# EAGLE design rpi2_gpio (EAGLE 7.6.0)
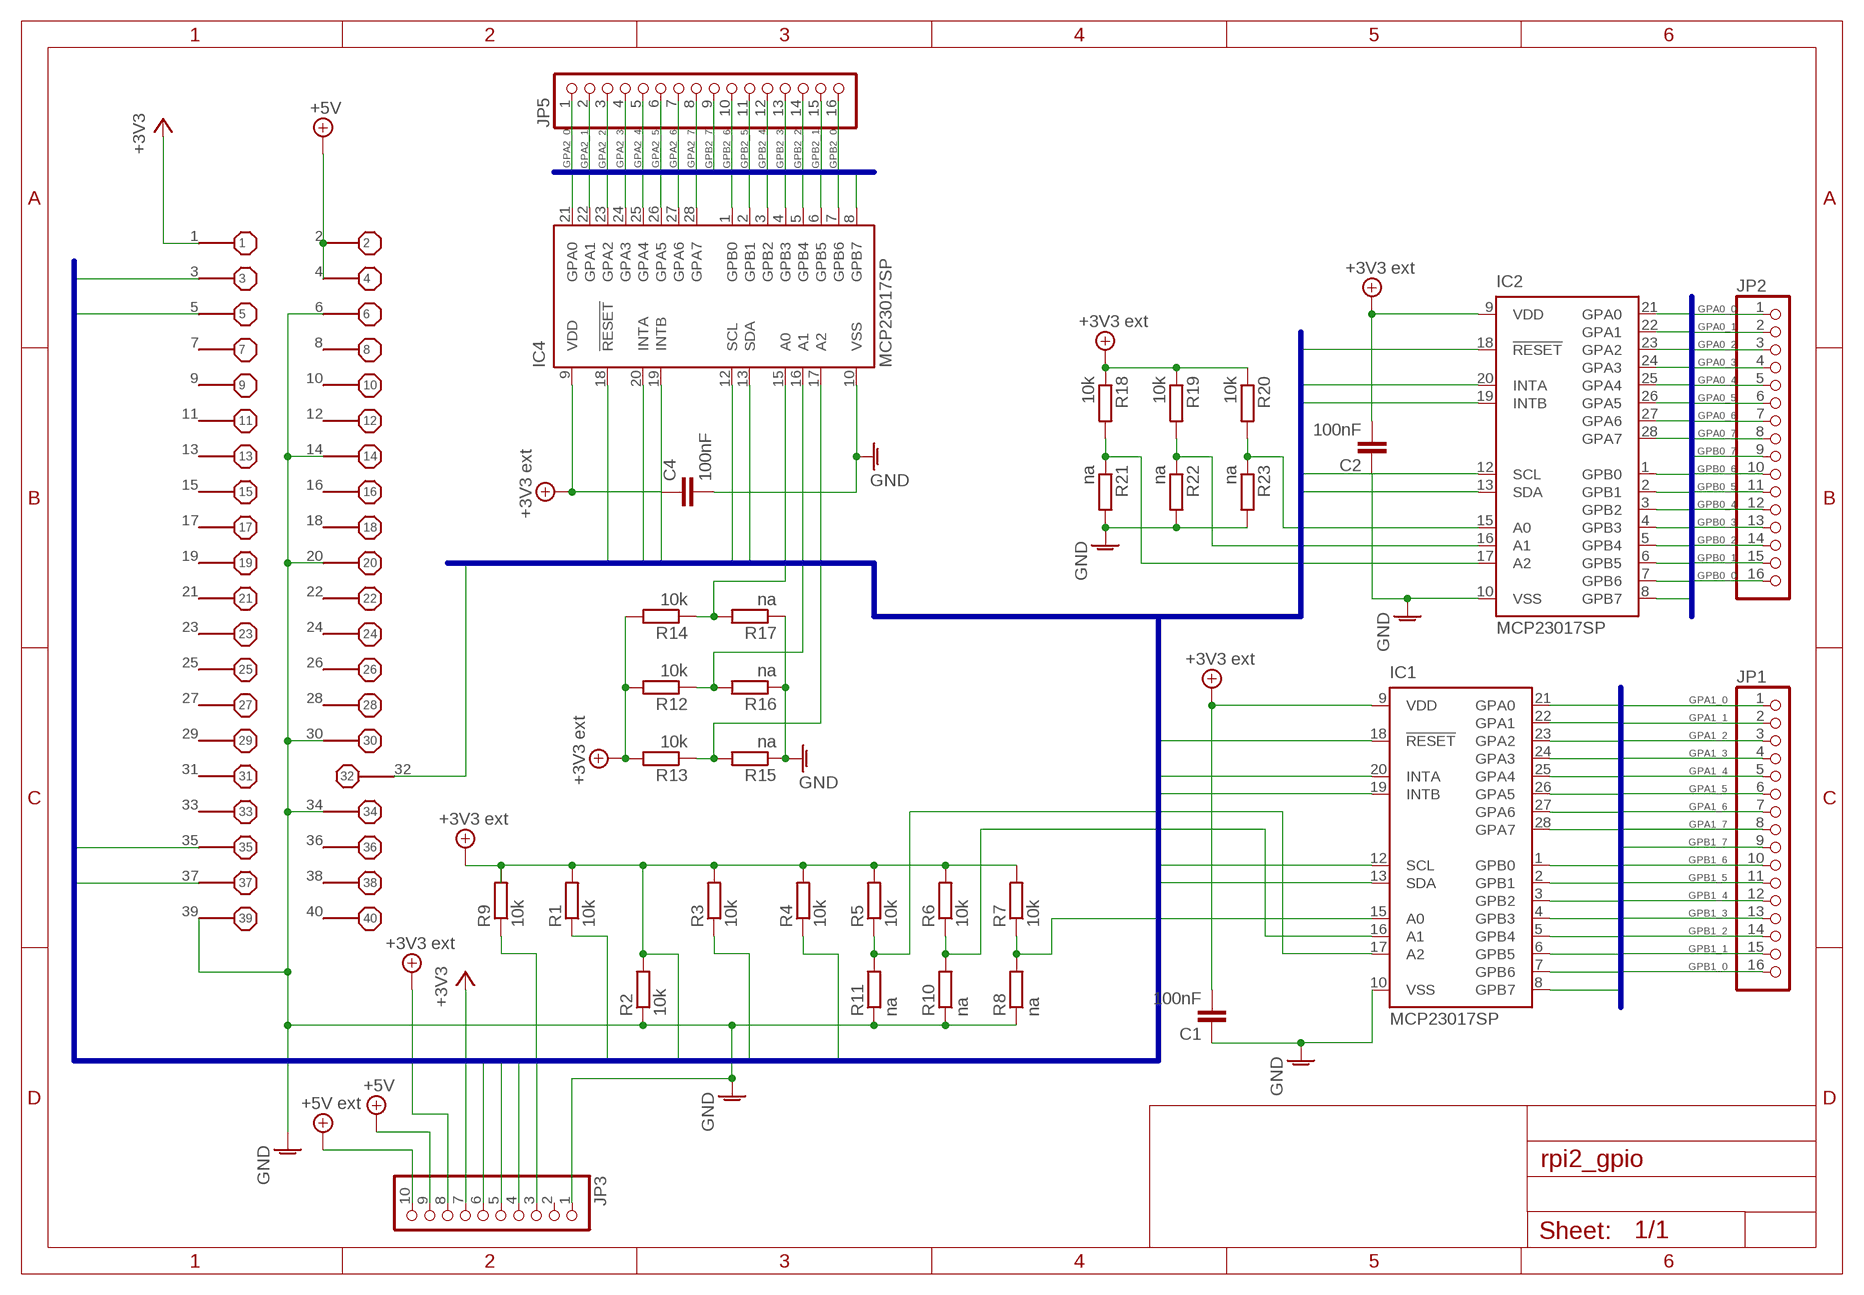
[diagram p0: schematic, sheet 1]

## Parts
C1  100nF  C-EUC1210  [C1210]
C2  100nF  C-EUC1210  [C1210]
C4  100nF  C-EUC1210  [C1210]
IC1  MCP23017SP  [DIL28-3]
IC2  MCP23017SP  [DIL28-3]
IC4  MCP23017SP  [DIL28-3]
JP1  PINHD-1X16  [1X16]
JP2  PINHD-1X16  [1X16]
JP3  PINHD-1X10  [1X10]
JP5  PINHD-1X16  [1X16]
R1  10k  R-EU_R0805  [R0805]
R2  10k  R-EU_R0805  [R0805]
R3  10k  R-EU_R0805  [R0805]
R4  10k  R-EU_R0805  [R0805]
R5  10k  R-EU_R0805  [R0805]
R6  10k  R-EU_R0805  [R0805]
R7  10k  R-EU_R0805  [R0805]
R8  na  R-EU_R0805  [R0805]
R9  10k  R-EU_R0805  [R0805]
R10  na  R-EU_R0805  [R0805]
R11  na  R-EU_R0805  [R0805]
R12  10k  R-EU_R0805  [R0805]
R13  10k  R-EU_R0805  [R0805]
R14  10k  R-EU_R0805  [R0805]
R15  na  R-EU_R0805  [R0805]
R16  na  R-EU_R0805  [R0805]
R17  na  R-EU_R0805  [R0805]
R18  10k  R-EU_R0805  [R0805]
R19  10k  R-EU_R0805  [R0805]
R20  10k  R-EU_R0805  [R0805]
R21  na  R-EU_R0805  [R0805]
R22  na  R-EU_R0805  [R0805]
R23  na  R-EU_R0805  [R0805]
X1  B+_GPIO  [B+_GPIO]

## Nets
3.3VEXT: IC1.18(!RESET) IC2.18(!RESET) IC4.18(!RESET) R1.2 R2.2 R3.2 R4.2 R5.2 R6.2 R7.2 R9.2 X1.32 ; supply symbol labelled +3V3 ext
3V3EXT: C1.2 IC1.9(VDD) R12.2 R13.2 R14.2 R18.1 R19.1 R20.1 ; supply symbol labelled +3V3 ext
+3V3: JP3.7 X1.1
+5V: JP3.9 X1.2 X1.4
+5V/1: JP3.10 ; supply symbol labelled +5V ext
+5V/2: C2.2 C4.1 IC2.9(VDD) IC4.9(VDD) JP3.8 ; supply symbol labelled +3V3 ext
GND: C1.1 C2.1 C4.2 IC1.10(VSS) IC2.10(VSS) IC4.10(VSS) JP3.1 R2.1 R8.1 R10.1 R11.1 R15.1 R16.1 R17.1 R21.2 R22.2 R23.2 X1.6 X1.14 X1.20 X1.30 X1.34 X1.39
GPA0_0: IC2.21(GPA0) JP2.1
GPA0_1: IC2.22(GPA1) JP2.2
GPA0_2: IC2.23(GPA2) JP2.3
GPA0_3: IC2.24(GPA3) JP2.4
GPA0_4: IC2.25(GPA4) JP2.5
GPA0_5: IC2.26(GPA5) JP2.6
GPA0_6: IC2.27(GPA6) JP2.7
GPA0_7: IC2.28(GPA7) JP2.8
GPA1_0: IC1.21(GPA0) JP1.1
GPA1_1: IC1.22(GPA1) JP1.2
GPA1_2: IC1.23(GPA2) JP1.3
GPA1_3: IC1.24(GPA3) JP1.4
GPA1_4: IC1.25(GPA4) JP1.5
GPA1_5: IC1.26(GPA5) JP1.6
GPA1_6: IC1.27(GPA6) JP1.7
GPA1_7: IC1.28(GPA7) JP1.8
GPA2_0: IC4.21(GPA0) JP5.1
GPA2_1: IC4.22(GPA1) JP5.2
GPA2_2: IC4.23(GPA2) JP5.3
GPA2_3: IC4.24(GPA3) JP5.4
GPA2_4: IC4.25(GPA4) JP5.5
GPA2_5: IC4.26(GPA5) JP5.6
GPA2_6: IC4.27(GPA6) JP5.7
GPA2_7: IC4.28(GPA7) JP5.8
GPB0_0: IC2.1(GPB0) JP2.16
GPB0_1: IC2.2(GPB1) JP2.15
GPB0_2: IC2.3(GPB2) JP2.14
GPB0_3: IC2.4(GPB3) JP2.13
GPB0_4: IC2.5(GPB4) JP2.12
GPB0_5: IC2.6(GPB5) JP2.11
GPB0_6: IC2.7(GPB6) JP2.10
GPB0_7: IC2.8(GPB7) JP2.9
GPB1_0: IC1.1(GPB0) JP1.16
GPB1_1: IC1.2(GPB1) JP1.15
GPB1_2: IC1.3(GPB2) JP1.14
GPB1_3: IC1.4(GPB3) JP1.13
GPB1_4: IC1.5(GPB4) JP1.12
GPB1_5: IC1.6(GPB5) JP1.11
GPB1_6: IC1.7(GPB6) JP1.10
GPB1_7: IC1.8(GPB7) JP1.9
GPB2_0: IC4.1(GPB0) JP5.16
GPB2_1: IC4.2(GPB1) JP5.15
GPB2_2: IC4.3(GPB2) JP5.14
GPB2_3: IC4.4(GPB3) JP5.13
GPB2_4: IC4.5(GPB4) JP5.12
GPB2_5: IC4.6(GPB5) JP5.11
GPB2_6: IC4.7(GPB6) JP5.10
GPB2_7: IC4.8(GPB7) JP5.9
INTA: IC1.20(INTA) IC2.20(INTA) IC4.20(INTA) JP3.5 R4.1 X1.37
INTB: IC1.19(INTB) IC2.19(INTB) IC4.19(INTB) JP3.6 R3.1 X1.35
N$1: IC1.17(A2) R5.1 R11.2
N$2: IC1.16(A1) R6.1 R10.2
N$5: IC2.17(A2) R18.2 R21.1
N$7: IC2.16(A1) R19.2 R22.1
N$8: IC1.15(A0) R7.1 R8.2
N$9: IC2.15(A0) R20.2 R23.1
N$20: IC4.17(A2) R13.1 R15.2
N$21: IC4.16(A1) R12.1 R16.2
N$22: IC4.15(A0) R14.1 R17.2
SCL: IC1.12(SCL) IC2.12(SCL) IC4.12(SCL) JP3.4 R1.1 X1.5
SDA: IC1.13(SDA) IC2.13(SDA) IC4.13(SDA) JP3.3 R9.1 X1.3
Unconnected: JP3.2 X1.7 X1.8 X1.9 X1.10 X1.11 X1.12 X1.13 X1.15 X1.16 X1.17 X1.18 X1.19 X1.21 X1.22 X1.23 X1.24 X1.25 X1.26 X1.27 X1.28 X1.29 X1.31 X1.33 X1.36 X1.38 X1.40

## Buses
GPA2_[0..7],GPB2_[0..7]
INTA,INTB,SCL,SDA,NRES
GPA0_[0..7],GPB0_[0..7]
GPA1_[0..7],GPB1_[0..7]

## Library data of the parts
C1 C2 C4 = rcl:C-EU: CAPACITOR, European symbol
IC1 IC2 IC4 = microchip:MCP23017: http://ww1.microchip.com/downloads/en/DeviceDoc/21952a.pdf Source: http://ww1.microchip.com/downloads/en/DeviceDoc/21952a.pdf; MF: MICROCHIP; MPN: MCP23017-E/SP; OC_FARNELL: 1332088; OC_NEWARK: 31K2959
JP1 JP2 JP5 = pinhead:PINHD-1X16: PIN HEADER
JP3 = pinhead:PINHD-1X10: PIN HEADER
R1-R23 = rcl:R-EU_: RESISTOR, European symbol
X1 = raspberry:B+_GPIO

## Board
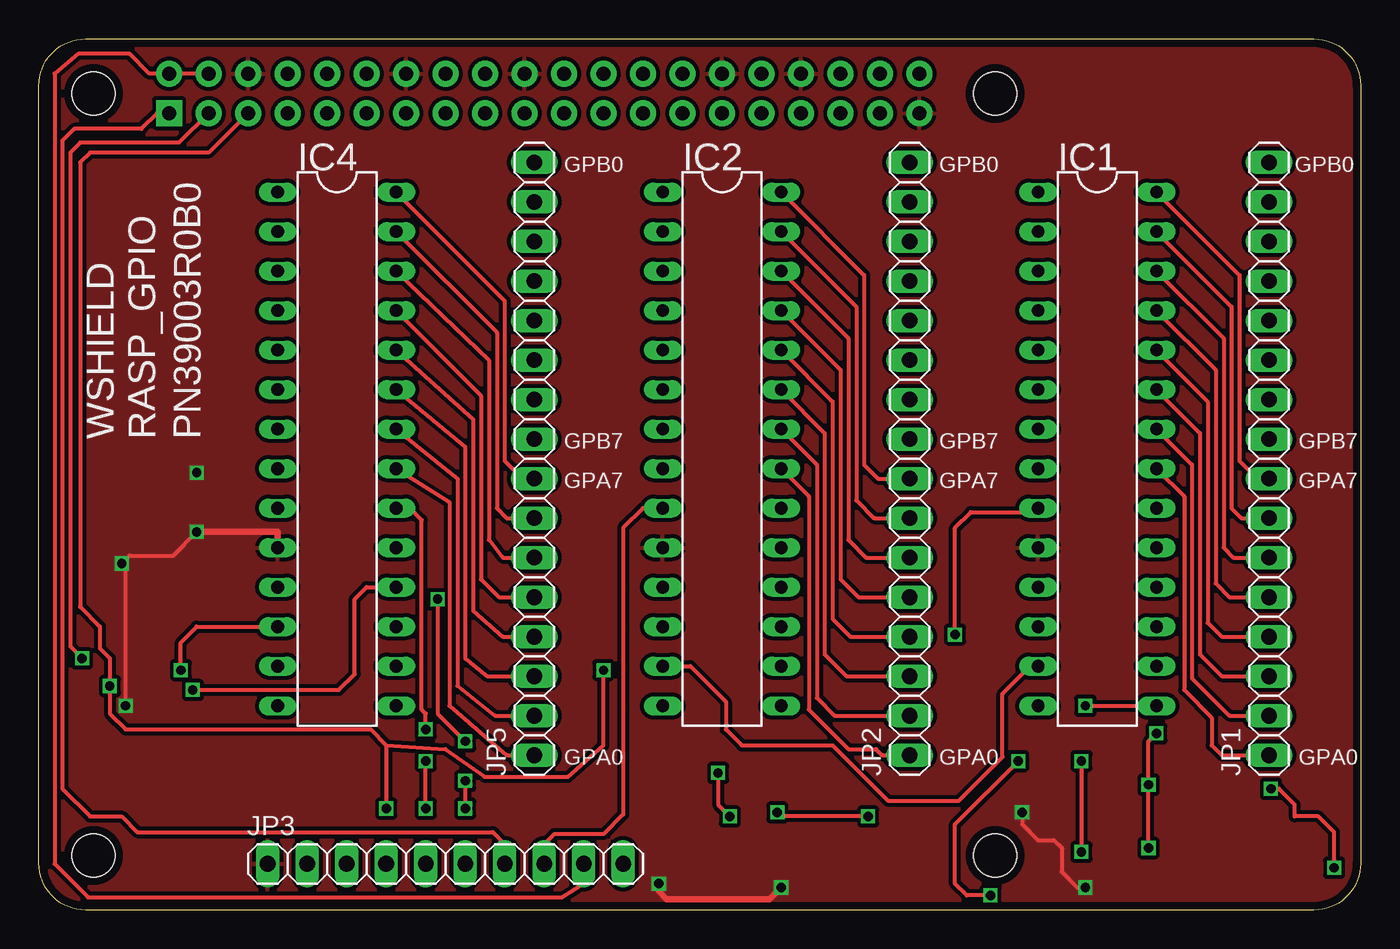
[diagram p1: board, top side]
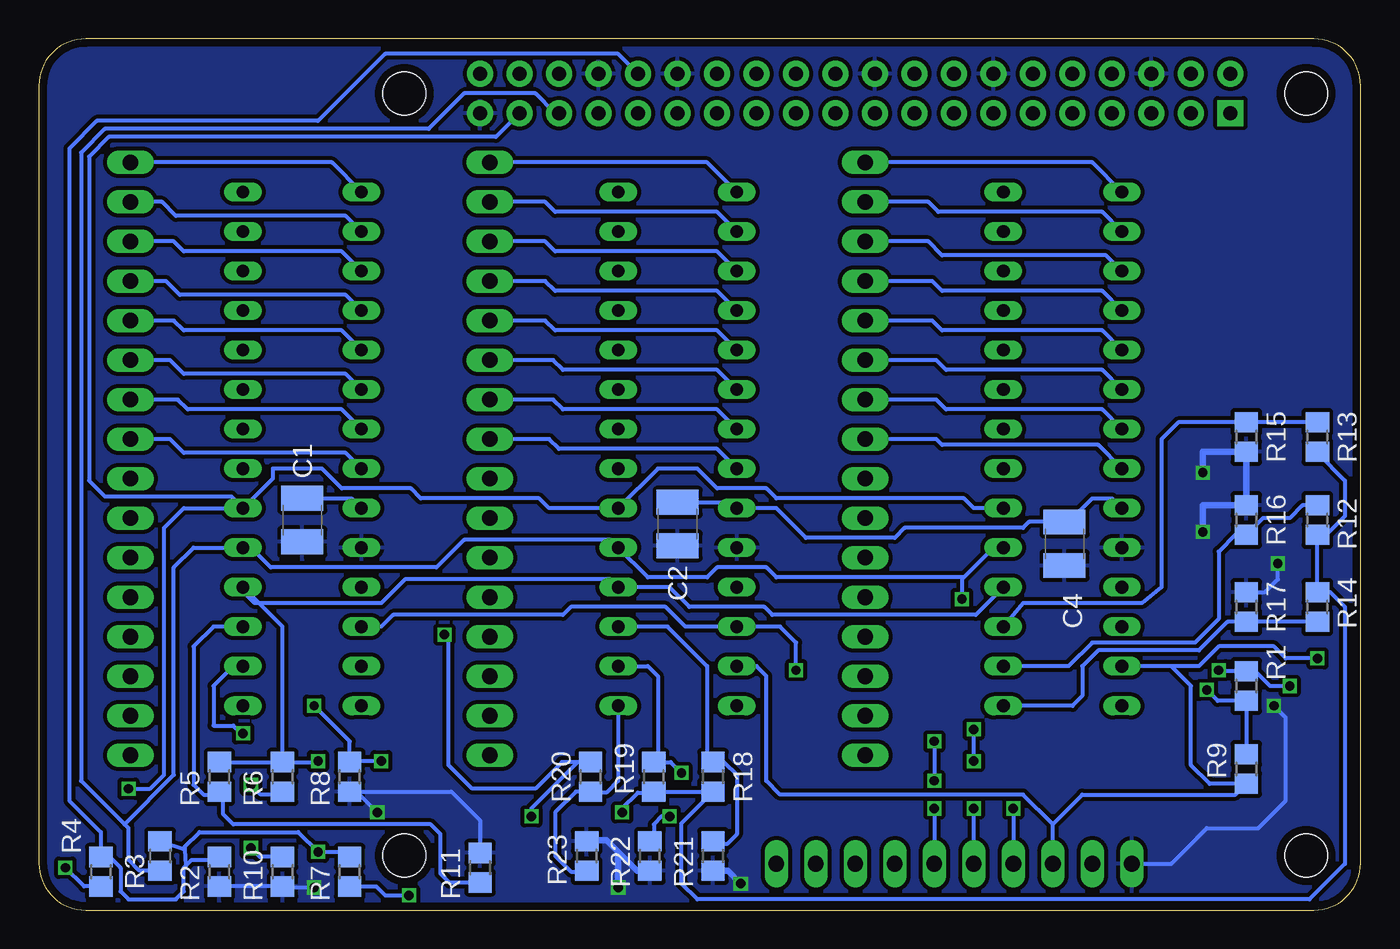
[diagram p2: board, bottom side, seen from below]

Size 85 x 56 mm. Coordinates in mm from the lower left corner, seen from the top.
Outline: 0,53 arc-90 3,56 82,56 arc-90 85,53 85,3 arc-90 82,0 3,0 arc-90 0,3 0,53
Copper layers (1*16): Top 0.035mm / dielectric 1.6mm / Bottom 0.035mm
Design rules "Elecrow_2-layer_PCB_eagle_rule": minimum track width 6mil, minimum drill 12mil, track to track 6mil, track to pad 6mil, pad to pad 6mil, via to via 8mil, smd to smd 0mil, copper to edge 20mil, drill to drill 10mil, minimum pad ring 6mil, minimum via ring 6mil, stop-mask expansion 0mil, vias tented up to drill 100mil, thermal gap 10mil
Holes 2.75 mm at 3.5,52.5 3.5,3.5 61.5,52.5 61.5,3.5

### Footprints (pad centres in the part's own frame; a part is rotated, then mirrored left to right if it is on the bottom)
C1210 = smd 1.6 x 2.7: 1 -1.4,0; 2 1.4,0
DIL28-3 = drill 0.813 long: 1 -16.51,-3.81; 2 -13.97,-3.81; 3 -11.43,-3.81; 4 -8.89,-3.81; 5 -6.35,-3.81; 6 -3.81,-3.81; 7 -1.27,-3.81; 8 1.27,-3.81; 9 3.81,-3.81; 10 6.35,-3.81; 11 8.89,-3.81; 12 11.43,-3.81; 13 13.97,-3.81; 14 16.51,-3.81; 15 16.51,3.81; 16 13.97,3.81; 17 11.43,3.81; 18 8.89,3.81; 19 6.35,3.81; 20 3.81,3.81; 21 1.27,3.81; 22 -1.27,3.81; 23 -3.81,3.81; 24 -6.35,3.81; 25 -8.89,3.81; 26 -11.43,3.81; 27 -13.97,3.81; 28 -16.51,3.81
1X16 = drill 1.016 long: 1 -19.05,0; 2 -16.51,0; 3 -13.97,0; 4 -11.43,0; 5 -8.89,0; 6 -6.35,0; 7 -3.81,0; 8 -1.27,0; 9 1.27,0; 10 3.81,0; 11 6.35,0; 12 8.89,0; 13 11.43,0; 14 13.97,0; 15 16.51,0; 16 19.05,0
1X10 = drill 1.016 long: 1 -11.43,0; 2 -8.89,0; 3 -6.35,0; 4 -3.81,0; 5 -1.27,0; 6 1.27,0; 7 3.81,0; 8 6.35,0; 9 8.89,0; 10 11.43,0
R0805 = smd 1.3 x 1.5: 1 -0.95,0; 2 0.95,0
B+_GPIO = drill 0.9 pad 1.676 square: 1 -24.13,-1.27 | drill 0.9 pad 1.676: 2 -24.13,1.27; 3 -21.59,-1.27; 4 -21.59,1.27; 5 -19.05,-1.27; 6 -19.05,1.27; 7 -16.51,-1.27; 8 -16.51,1.27; 9 -13.97,-1.27; 10 -13.97,1.27; 11 -11.43,-1.27; 12 -11.43,1.27; 13 -8.89,-1.27; 14 -8.89,1.27; 15 -6.35,-1.27; 16 -6.35,1.27; 17 -3.81,-1.27; 18 -3.81,1.27; 19 -1.27,-1.27; 20 -1.27,1.27; 21 1.27,-1.27; 22 1.27,1.27; 23 3.81,-1.27; 24 3.81,1.27; 25 6.35,-1.27; 26 6.35,1.27; 27 8.89,-1.27; 28 8.89,1.27; 29 11.43,-1.27; 30 11.43,1.27; 31 13.97,-1.27; 32 13.97,1.27; 33 16.51,-1.27; 34 16.51,1.27; 35 19.05,-1.27; 36 19.05,1.27; 37 21.59,-1.27; 38 21.59,1.27; 39 24.13,-1.27; 40 24.13,1.27

### Placement (x,y rotation side)
C1  68.06,25.07 90 bottom
C2  43.93,24.81 90 bottom
C4  19.04,23.54 270 bottom
IC1  68.06,29.64 270 top
IC2  43.93,29.64 270 top
IC4  19.16,29.64 270 top
JP1  79.11,29 90 top
JP2  55.99,29 90 top
JP3  26.15,2.97 0 top
JP5  31.87,29 90 top
R1  7.35,14.4 270 bottom
R2  73.39,2.46 90 bottom
R3  77.2,3.48 90 bottom
R4  81.01,2.46 90 bottom
R5  73.39,8.56 90 bottom
R6  69.33,8.56 90 bottom
R7  65.01,2.46 90 bottom
R8  65.01,8.56 90 bottom
R9  7.35,9.07 90 bottom
R10  69.33,2.46 90 bottom
R11  56.63,2.72 270 bottom
R12  2.78,25.07 270 bottom
R13  2.78,30.4 270 bottom
R14  2.78,19.48 90 bottom
R15  7.35,30.4 90 bottom
R16  7.35,25.07 270 bottom
R17  7.35,19.48 270 bottom
R18  41.64,8.56 90 bottom
R19  45.45,8.56 90 bottom
R20  49.52,8.56 270 bottom
R21  41.64,3.48 270 bottom
R22  45.71,3.48 270 bottom
R23  49.77,3.48 90 bottom
X1  32.5,52.5 0 top

### Tracks (layer width: path | path; a pad name or v marks a point on that pad's centre or on a via)
3.3VEXT  (via drill 0.6)
  Top 0.254: v9.89,14.15 19.29,14.15 20.31,15.16 20.31,19.99 21.07,20.75 IC4.18 | v67.04,9.57 v67.04,3.73
  Bottom 0.254: IC4.18 24.75,18.97 37.83,18.97 38.34,19.48 43.17,19.48 44.44,20.75 IC2.18 48.25,21.26 61.46,21.26 62.98,19.73 71.11,19.73 72.12,20.75 IC1.18 69.33,18.21 R6.2 | R9.2 R1.2 9.2,13.45 v9.89,14.15 | X1.32 47.74,55.04 62.73,55.04 67.04,50.72 81.27,50.72 83.05,48.94 83.05,7.03 81.01,5 R4.2 80.44,3.41 79.74,2.72 79.74,1.19 79.24,0.68 76.19,0.68 75.68,1.19 75.68,2.72 75.55,2.84 | 75.55,2.84 75.17,3.22 73.58,3.22 R2.2 | R3.2 75.61,3.92 | 75.61,3.92 75.55,2.84 | R5.2 R6.2 | R6.2 67.11,9.51 v67.04,9.57 | R7.2 65.33,3.73 v67.04,3.73 68.31,5 74.66,5 75.61,4.05 75.61,3.92
3V3EXT  (via drill 0.6)
  Top 0.254: v58.92,17.7 58.92,24.56 59.93,25.58 64,25.58 IC1.9 | v53.33,6.02 47.74,6.02 v47.49,6.27
  Bottom 0.254: R13.2 2.78,29.39 1,27.61 1,25.32 2.27,24.05 2.72,24.05 R12.2 R14.2 1.95,20.43 1,19.48 1,2.97 3.29,0.68 42.66,0.68 43.68,1.7 43.68,5.58 R18.1 R19.1 45.52,7.54 46.47,7.54 47.49,6.53 v47.49,6.27 | v58.92,17.7 58.66,17.45 58.66,9.32 57.14,7.8 53.07,7.8 51.36,9.51 R20.1 50.35,9.51 53.33,6.53 v53.33,6.02 | C1.2 64.89,26.47 IC1.9
+3V3
  Top 0.254: X1.1 7.61,51.23 6.59,50.21 2.27,50.21 1.51,49.45 1.51,7.8 3.29,6.02 5.32,6.02 6.34,5 29.2,5 29.96,4.24 JP3.7
+5V
  Top 0.254: X1.2 X1.4 7.1,53.77 5.83,55.04 2.53,55.04 1,53.77 1,2.97 3.16,0.81 33.64,0.81 35.04,1.7 JP3.9
+5V/2
  Top 0.254: IC2.9 38.85,25.83 37.58,24.56 37.58,6.15 36.31,4.88 33.13,4.88 32.5,4.24 JP3.8
  Bottom 0.254: IC4.9 15.99,26.46 17.26,26.46 18.78,24.94 C4.1 21.32,24.94 21.71,24.56 29.32,24.56 29.96,23.93 35.68,23.93 37.58,25.83 IC2.9 40.5,26.21 C2.2
GND  (via drill 0.6)
  Top 0.254: v63.23,6.27 63.23,5.51 64.25,4.49 65.27,4.49 65.77,3.99 65.77,2.46 66.79,1.45 v67.3,1.45 | v10.15,24.31 8.62,22.78 5.83,22.78 v5.32,22.27 5.58,22.02 v5.58,13.13
  Top 0.406: v10.15,24.31 15.36,24.31 IC4.10 | v39.87,1.7 39.87,1.19 40.37,0.68 46.98,0.68 v47.74,1.45
  Bottom 0.254: R11.1 56.63,5.76 58.47,7.61 R8.1 64.57,7.61 v63.23,6.27 | v67.3,1.45 69.26,1.45 R10.1 R2.1 | R17.1 6.15,20.43 5.32,21.26 v5.32,22.27 | JP3.1 12.18,2.97 9.89,5.26 6.59,5.26 4.81,7.03 4.81,12.37 v5.58,13.13
  Bottom 0.406: 10.15,27.86 v10.15,28.12 10.15,29.45 R15.1 R16.1 10.15,26.02 v10.15,24.31 | R21.2 40.69,2.53 v39.87,1.7 | v47.74,1.45 47.74,3.73 | 47.74,3.73 48.5,4.49 49.71,4.49 R23.2 | R22.2 46.54,2.53 47.74,3.73
  pour Top (isolate 0.254): -0.01,53.26 arc-90 2.78,56.06 3.04,56.06 82.28,56.06 arc-90 85.08,53.26 85.08,2.72 arc-90 82.28,-0.08 81.78,-0.08 3.04,-0.08 arc-90 -0.01,2.97
  pour Bottom (isolate 0.254): -0.01,53.26 arc-90 2.78,56.06 3.04,56.06 82.54,56.06 arc-90 85.08,53.52 85.08,53.26 85.08,2.46 arc-90 82.54,-0.08 82.03,-0.08 3.04,-0.08 arc-90 -0.01,2.97
GPA0_0
  Top 0.254: IC2.21 49.52,26.59 49.52,12.88 52.06,10.34 53.84,10.34 54.22,9.96 JP2.1
GPA0_1
  Top 0.254: IC2.22 50.03,28.62 50.03,13.64 51.17,12.5 JP2.2
GPA0_2
  Top 0.254: IC2.23 50.53,30.66 50.53,16.43 51.93,15.04 JP2.3
GPA0_3
  Top 0.254: IC2.24 51.04,32.69 51.04,18.72 52.19,17.57 JP2.4
GPA0_4
  Top 0.254: IC2.25 51.55,34.72 51.55,21.26 52.69,20.12 JP2.5
GPA0_5
  Top 0.254: IC2.26 52.06,36.75 52.06,23.8 53.2,22.66 JP2.6
GPA0_6
  Top 0.254: IC2.27 52.57,38.78 52.57,26.34 53.71,25.2 JP2.7
GPA0_7
  Top 0.254: IC2.28 53.07,40.82 53.07,28.62 53.96,27.73 JP2.8
GPA1_0
  Top 0.254: IC1.21 73.65,26.59 73.65,14.15 75.43,12.37 75.43,10.59 76.06,9.96 JP1.1
GPA1_1
  Top 0.254: IC1.22 74.16,28.62 74.16,14.91 76.57,12.5 JP1.2
GPA1_2
  Top 0.254: IC1.23 74.66,30.66 74.66,16.43 76.06,15.04 JP1.3
GPA1_3
  Top 0.254: IC1.24 75.17,32.69 75.17,18.46 76.06,17.57 JP1.4
GPA1_4
  Top 0.254: IC1.25 75.68,34.72 75.68,21 76.57,20.12 JP1.5
GPA1_5
  Top 0.254: IC1.26 76.19,36.75 76.19,23.29 76.82,22.66 JP1.6
GPA1_6
  Top 0.254: IC1.27 76.7,38.78 76.7,25.83 77.33,25.2 JP1.7
GPA1_7
  Top 0.254: IC1.28 77.2,40.82 77.2,28.88 78.35,27.73 JP1.8
GPA2_0
  Top 0.254: IC4.21 26.4,26.21 26.4,13.13 30.09,9.96 JP5.1
GPA2_1
  Top 0.254: IC4.22 26.91,27.73 26.91,14.4 29.32,12.5 JP5.2
GPA2_2
  Top 0.254: IC4.23 27.42,29.77 27.42,16.18 28.82,15.04 JP5.3
GPA2_3
  Top 0.254: IC4.24 27.93,31.55 27.93,19.23 29.83,17.57 JP5.4
GPA2_4
  Top 0.254: IC4.25 28.44,33.07 28.44,21.26 29.58,20.12 JP5.5
GPA2_5
  Top 0.254: IC4.26 28.94,35.36 28.94,23.8 29.83,22.66 JP5.6
GPA2_6
  Top 0.254: IC4.27 29.45,37.13 29.45,25.83 30.09,25.2 JP5.7
GPA2_7
  Top 0.254: IC4.28 29.96,39.16 29.96,28.88 31.1,27.73 JP5.8
GPB0_0
  Bottom 0.254: IC2.1 42.02,48.05 JP2.16
GPB0_1
  Bottom 0.254: IC2.2 41.39,44.88 51.8,44.88 52.44,45.52 JP2.15
GPB0_2
  Bottom 0.254: IC2.3 41.39,42.34 51.8,42.34 52.44,42.98 JP2.14
GPB0_3
  Bottom 0.254: IC2.4 41.39,39.8 51.8,39.8 52.44,40.44 JP2.13
GPB0_4
  Bottom 0.254: IC2.5 41.39,37.26 51.8,37.26 52.44,37.9 JP2.12
GPB0_5
  Bottom 0.254: IC2.6 41.39,34.72 51.3,34.72 51.93,35.36 JP2.11
GPB0_6
  Bottom 0.254: IC2.7 41.39,32.18 51.3,32.18 51.93,32.81 JP2.10
GPB0_7
  Bottom 0.254: IC2.8 41.39,29.64 51.55,29.64 52.19,30.27 JP2.9
GPB1_0
  Bottom 0.254: IC1.1 66.15,48.05 JP1.16
GPB1_1
  Bottom 0.254: IC1.2 65.27,44.63 76.19,44.63 77.08,45.52 JP1.15
GPB1_2
  Bottom 0.254: IC1.3 65.52,42.34 75.68,42.34 76.31,42.98 JP1.14
GPB1_3
  Bottom 0.254: IC1.4 65.27,39.55 75.93,39.55 76.82,40.44 JP1.13
GPB1_4
  Bottom 0.254: IC1.5 65.52,37.26 75.68,37.26 76.31,37.9 JP1.12
GPB1_5
  Bottom 0.254: IC1.6 65.27,34.47 75.68,34.47 76.57,35.36 JP1.11
GPB1_6
  Bottom 0.254: IC1.7 65.52,32.18 75.43,32.18 76.06,32.81 JP1.10
GPB1_7
  Bottom 0.254: IC1.8 65.27,29.39 75.68,29.39 76.57,30.27 JP1.9
GPB2_0
  Bottom 0.254: IC4.1 17.26,48.05 JP5.16
GPB2_1
  Bottom 0.254: IC4.2 16.62,44.88 27.17,44.88 27.8,45.52 JP5.15
GPB2_2
  Bottom 0.254: IC4.3 16.37,42.09 26.91,42.09 27.8,42.98 JP5.14
GPB2_3
  Bottom 0.254: IC4.4 16.62,39.8 26.91,39.8 27.55,40.44 JP5.13
GPB2_4
  Bottom 0.254: IC4.5 16.62,37.26 26.91,37.26 27.55,37.9 JP5.12
GPB2_5
  Bottom 0.254: IC4.6 16.62,34.72 26.66,34.72 27.29,35.36 JP5.11
GPB2_6
  Bottom 0.254: IC4.7 16.62,32.18 26.66,32.18 27.29,32.81 JP5.10
GPB2_7
  Bottom 0.254: IC4.8 16.88,29.89 26.91,29.89 27.29,30.27 JP5.9
INTA  (via drill 0.6)
  Top 0.254: v83.3,2.72 83.3,5 82.28,6.02 80.76,6.02 80.76,6.78 79.74,7.8 v79.24,7.8 | v24.88,6.53 v24.88,9.57 | v24.88,11.61 24.88,12.62 24.63,12.88 24.63,25.07 23.86,25.83 IC4.20
  Bottom 0.254: IC4.20 24.88,25.83 25.52,26.46 37.58,26.46 38.22,27.1 41.39,27.1 42.66,28.37 45.2,28.37 IC2.20 52.19,25.83 52.82,26.46 60.44,26.46 61.08,27.1 65.52,27.1 66.79,28.37 69.96,28.37 69.96,27.73 IC1.20 | R4.1 82.1,1.51 v83.3,2.72 | IC1.20 75.68,25.83 76.95,24.56 76.95,8.69 77.84,7.8 v79.24,7.8 | X1.37 55.61,49.71 80.51,49.71 81.78,48.44 81.78,27.61 80.76,26.59 72.63,26.59 IC1.20 | JP3.5 v24.88,6.53 | v24.88,9.57 v24.88,11.61
INTB  (via drill 0.6)
  Top 0.254: v25.64,19.99 25.64,12.62 v27.42,10.84 | v27.42,8.3 v27.42,6.53
  Bottom 0.254: IC4.19 23.61,23.29 25.52,21.39 25.64,21.39 | 25.64,21.39 37.58,21.39 38.22,22.02 41.39,22.02 42.02,21.39 45.84,21.39 IC2.19 48.25,23.8 57.65,23.8 59.42,22.02 70.09,22.02 71.36,23.29 IC1.19 75.04,23.29 76.31,22.02 76.31,8.69 79.49,5.51 | X1.35 51.8,51.23 53.07,52.5 57.65,52.5 59.93,50.21 80.76,50.21 82.28,48.69 82.28,8.3 79.49,5.51 | R3.1 78.54,2.53 79.24,3.22 79.24,5.26 79.49,5.51 | 25.64,21.39 v25.64,19.99 | v27.42,10.84 v27.42,8.3 | v27.42,6.53 JP3.6
N$1
  Bottom 0.254: IC1.17 73.77,18.21 75.04,16.94 75.04,8.05 74.41,7.42 73.59,7.42 R5.1 73.14,7.35 73.14,6.15 72.5,5.51 59.8,5.51 59.17,4.88 59.17,2.34 58.6,1.77 R11.2
N$2  (via drill 0.6)
  Top 0.254: v71.87,11.35 71.36,10.84 v71.36,8.05 v71.36,3.99
  Bottom 0.254: IC1.16 72.5,15.67 73.77,14.4 73.77,11.86 72.5,11.86 72,11.35 v71.87,11.35 | R6.1 69.52,7.42 70.73,7.42 v71.36,8.05 | R10.2 70.79,3.41 v71.36,3.99
N$5
  Bottom 0.254: IC2.17 44.56,18.21 42.02,15.67 42.02,9.89 R18.2 40.94,9.51 40.12,8.69 40.12,4.88 40.76,4.24 41.46,4.24 R21.1
N$7  (via drill 0.6)
  Top 0.254: v43.68,8.81 43.68,6.78 v44.44,6.02
  Bottom 0.254: IC2.16 45.84,15.67 45.2,15.04 45.2,9.76 R19.2 44.37,9.51 v43.68,8.81 | v44.44,6.02 44.95,6.02 45.45,5.51 45.45,4.68 R22.1
N$8  (via drill 0.6)
  Top 0.254: v67.3,13.13 IC1.15 | v61.2,0.94 59.68,0.94 58.92,1.7 58.92,5.51 v62.98,9.57
  Bottom 0.254: v67.3,13.13 65.01,10.84 R8.2 64.95,9.57 v62.98,9.57 | R7.1 63.3,1.51 62.73,0.94 v61.2,0.94
N$9
  Bottom 0.254: IC2.15 47.74,8.3 48.5,7.54 49.45,7.54 R20.2 50.47,7.61 51.8,6.27 51.8,3.48 50.79,2.46 49.84,2.46 R23.1
N$20
  Bottom 0.254: R13.1 R15.2 11.74,31.35 12.82,30.27 12.82,20.75 14.09,19.73 21.71,19.73 IC4.17
N$21
  Bottom 0.254: R12.1 3.74,26.02 4.56,25.2 6.28,25.2 R16.2 8.05,24.12 9.13,23.04 9.13,18.72 10.66,17.19 17.26,17.19 18.78,15.67 IC4.16
N$22
  Bottom 0.254: R14.1 R17.2 8.56,18.53 10.4,16.69 16.88,16.69 17.89,15.67 17.89,13.77 18.53,13.13 IC4.15
SCL  (via drill 0.6)
  Top 0.254: X1.5 10.91,48.69 3.29,48.69 2.66,48.05 2.66,19.48 3.92,18.21 3.92,16.81 4.56,16.18 v4.56,14.4 4.56,12.62 5.58,11.61 21.32,11.61 22.34,10.59 | 22.34,10.59 26.15,10.34 28.69,8.56 34.02,8.56 36.31,10.59 v36.31,15.42 | 22.34,10.59 v22.34,6.53 | v9.13,15.42 9.13,17.19 10.15,18.21 IC4.12
  Bottom 0.254: IC1.12 62.98,18.21 62.22,18.97 51.3,18.97 50.79,19.48 44.69,19.48 43.42,18.21 IC2.12 37.33,18.21 36.31,17.19 v36.31,15.42 | v4.56,14.4 5.83,14.4 6.78,15.35 R1.1 9.07,15.35 v9.13,15.42 | v22.34,6.53 JP3.4
SDA  (via drill 0.6)
  Top 0.254: IC2.13 41.9,15.67 44.18,13.38 44.18,11.61 45.2,10.59 51.04,10.59 54.6,7.03 59.17,7.03 61.96,9.83 61.96,13.89 63.74,15.67 IC1.13 | X1.3 9,49.33 2.66,49.33 2.02,48.69 2.02,16.94 v2.78,16.18
  Bottom 0.254: JP3.3 19.8,5.51 | 19.8,5.51 21.71,7.42 37.33,7.42 38.22,8.3 38.22,15.04 38.85,15.67 IC2.13 | 19.8,5.51 17.89,7.42 8.05,7.42 R9.1 9.71,8.12 10.91,9.32 10.91,14.4 12.18,15.67 IC4.13 10.4,15.67 9.13,16.94 5.58,16.94 4.81,16.18 v2.78,16.18

### Text on the board
tNames: GPB0 | GPB0 | GPB0 | WSHIELD / RASP_GPIO | PN39003R0B0 | GPB7 | GPB7 | GPB7 | GPA7 | GPA7 | GPA7 | GPA0 | GPA0 | GPA0